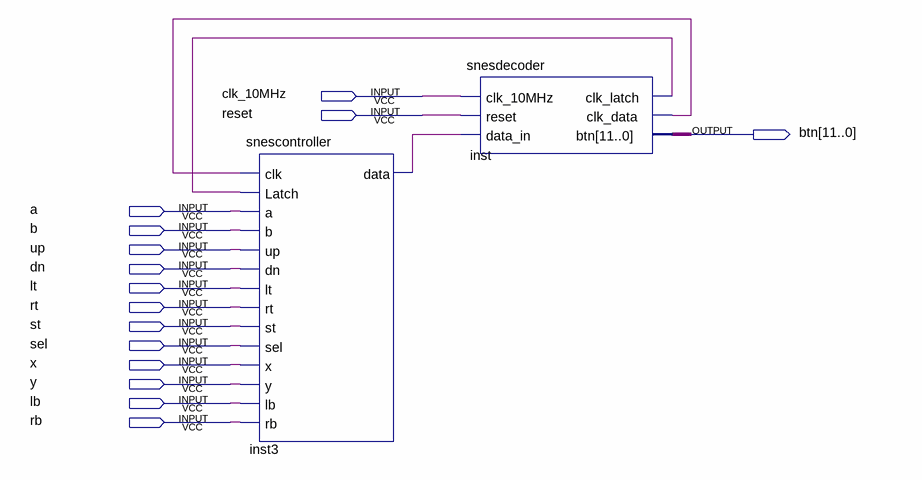
[diagram p0: schematic sheet]
// Quartus schematic snestest.bdf as structural Verilog: 2 symbols, 15 pins
module snestest (
  input  clk_10MHz,
  input  reset,
  input  a,
  input  b,
  input  up,
  input  dn,
  input  lt,
  input  rt,
  input  st,
  input  sel,
  input  x,
  input  y,
  input  lb,
  input  rb,
  output [11:0] btn
);

  wire inst3_data, inst_clk_data, inst_clk_latch;

  snescontroller inst3 (
    .clk(inst_clk_data), .Latch(inst_clk_latch), .a(a), .b(b), .up(up), .dn(dn), .lt(lt), .rt(rt), .st(st),
    .sel(sel), .x(x), .y(y), .lb(lb), .rb(rb), .data(inst3_data));
  snesdecoder inst (
    .clk_10MHz(clk_10MHz), .reset(reset), .data_in(inst3_data), .clk_latch(inst_clk_latch),
    .clk_data(inst_clk_data), .btn(btn));
endmodule
